# EAGLE schematic SDMAC_revb (EAGLE 9.6.2)

## Sheet 1 of 3
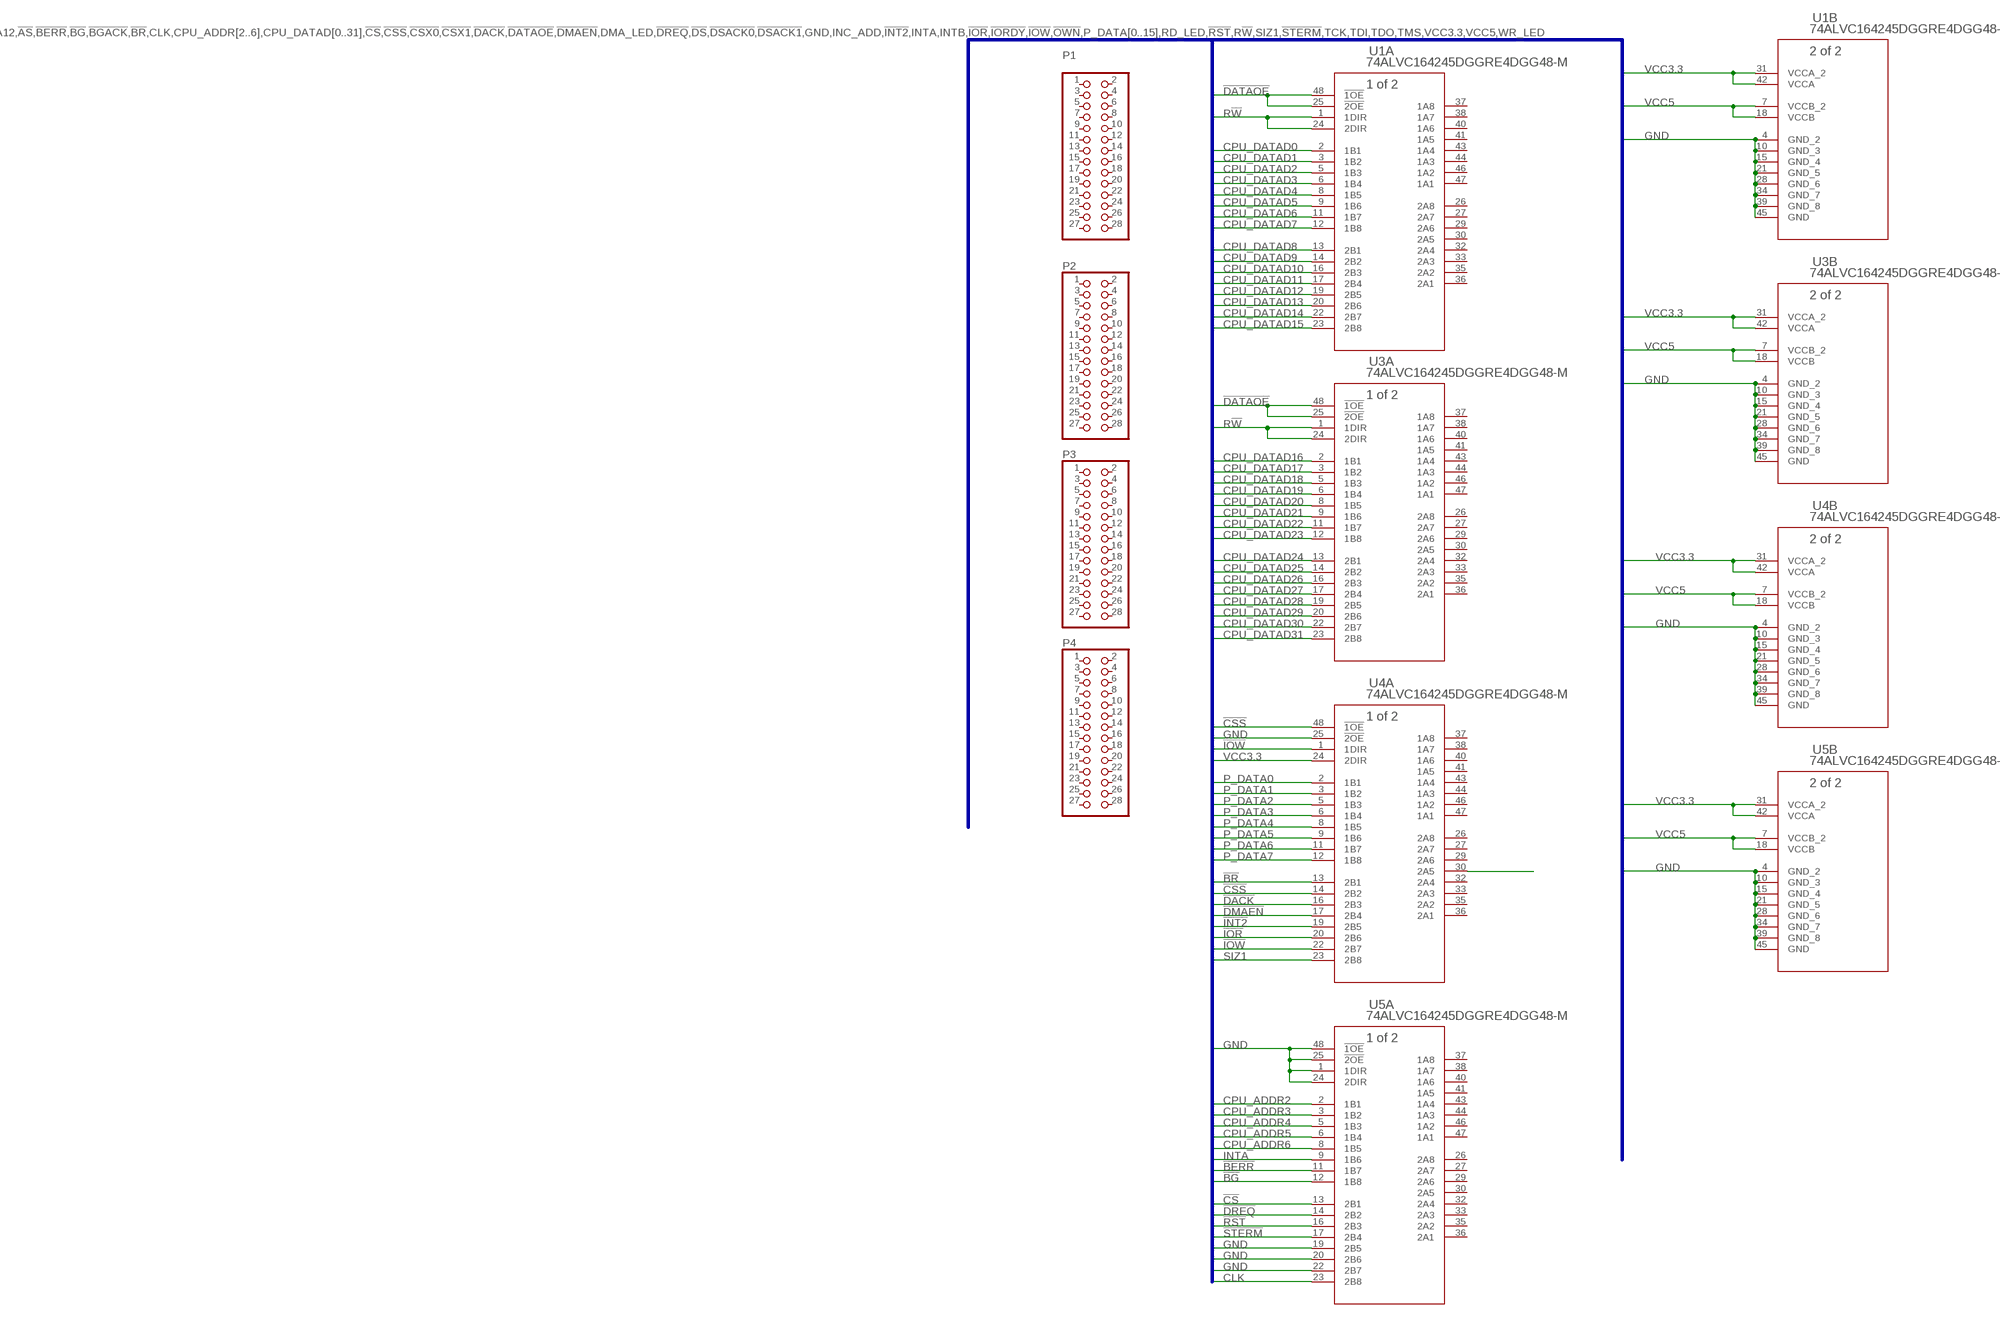
[diagram p0: schematic, sheet 1]

### Parts
P1  PINHD-2X14  [2X14]
P2  PINHD-2X14  [2X14]
P3  PINHD-2X14  [2X14]
P4  PINHD-2X14  [2X14]
U1  74ALVC164245DGGRE4DGG48-M  [DGG48-M]
U3  74ALVC164245DGGRE4DGG48-M  [DGG48-M]
U4  74ALVC164245DGGRE4DGG48-M  [DGG48-M]
U5  74ALVC164245DGGRE4DGG48-M  [DGG48-M]

### Nets
!BERR: U5.11(A:1B7) ; also sheet 2
!BG: U5.12(A:1B8) ; also sheet 2
!BR: U4.13(A:2B1) ; also sheet 2
!CS: U5.13(A:2B1) ; also sheet 2
!CSS: U4.14(A:2B2) U4.48(A:!1OE) ; also sheet 2
!DACK: U4.16(A:2B3) ; also sheet 2
!DATAOE: U1.25(A:!2OE) U1.48(A:!1OE) U3.25(A:!2OE) U3.48(A:!1OE)
!DMAEN: U4.17(A:2B4) ; also sheet 2
!DREQ: U5.14(A:2B2) ; also sheet 2
!INT2: U4.19(A:2B5) ; also sheet 2
!IOR: U4.20(A:2B6) ; also sheet 2
!IOW: U4.1(A:1DIR) U4.22(A:2B7) ; also sheet 2
!RST: U5.16(A:2B3) ; also sheet 2
!STERM: U5.17(A:2B4) ; also sheet 2
CLK: U5.23(A:2B8) ; also sheet 2
CPU_ADDR2: U5.2(A:1B1) ; also sheet 2
CPU_ADDR3: U5.3(A:1B2) ; also sheet 2
CPU_ADDR4: U5.5(A:1B3) ; also sheet 2
CPU_ADDR5: U5.6(A:1B4) ; also sheet 2
CPU_ADDR6: U5.8(A:1B5) ; also sheet 2
CPU_DATAD0: U1.2(A:1B1) ; also sheet 2
CPU_DATAD1: U1.3(A:1B2) ; also sheet 2
CPU_DATAD2: U1.5(A:1B3) ; also sheet 2
CPU_DATAD3: U1.6(A:1B4) ; also sheet 2
CPU_DATAD4: U1.8(A:1B5) ; also sheet 2
CPU_DATAD5: U1.9(A:1B6) ; also sheet 2
CPU_DATAD6: U1.11(A:1B7) ; also sheet 2
CPU_DATAD7: U1.12(A:1B8) ; also sheet 2
CPU_DATAD8: U1.13(A:2B1) ; also sheet 2
CPU_DATAD9: U1.14(A:2B2) ; also sheet 2
CPU_DATAD10: U1.16(A:2B3) ; also sheet 2
CPU_DATAD11: U1.17(A:2B4) ; also sheet 2
CPU_DATAD12: U1.19(A:2B5) ; also sheet 2
CPU_DATAD13: U1.20(A:2B6) ; also sheet 2
CPU_DATAD14: U1.22(A:2B7) ; also sheet 2
CPU_DATAD15: U1.23(A:2B8) ; also sheet 2
CPU_DATAD16: U3.2(A:1B1) ; also sheet 2
CPU_DATAD17: U3.3(A:1B2) ; also sheet 2
CPU_DATAD18: U3.5(A:1B3) ; also sheet 2
CPU_DATAD19: U3.6(A:1B4) ; also sheet 2
CPU_DATAD20: U3.8(A:1B5) ; also sheet 2
CPU_DATAD21: U3.9(A:1B6) ; also sheet 2
CPU_DATAD22: U3.11(A:1B7) ; also sheet 2
CPU_DATAD23: U3.12(A:1B8) ; also sheet 2
CPU_DATAD24: U3.13(A:2B1) ; also sheet 2
CPU_DATAD25: U3.14(A:2B2) ; also sheet 2
CPU_DATAD26: U3.16(A:2B3) ; also sheet 2
CPU_DATAD27: U3.17(A:2B4) ; also sheet 2
CPU_DATAD28: U3.19(A:2B5) ; also sheet 2
CPU_DATAD29: U3.20(A:2B6) ; also sheet 2
CPU_DATAD30: U3.22(A:2B7) ; also sheet 2
CPU_DATAD31: U3.23(A:2B8) ; also sheet 2
GND: U1.4(B:GND_2) U1.10(B:GND_3) U1.15(B:GND_4) U1.21(B:GND_5) U1.28(B:GND_6) U1.34(B:GND_7) U1.39(B:GND_8) U1.45(B:GND) U3.4(B:GND_2) U3.10(B:GND_3) U3.15(B:GND_4) U3.21(B:GND_5) U3.28(B:GND_6) U3.34(B:GND_7) U3.39(B:GND_8) U3.45(B:GND) U4.4(B:GND_2) U4.10(B:GND_3) U4.15(B:GND_4) U4.21(B:GND_5) U4.25(A:!2OE) U4.28(B:GND_6) U4.34(B:GND_7) U4.39(B:GND_8) U4.45(B:GND) U5.1(A:1DIR) U5.4(B:GND_2) U5.10(B:GND_3) U5.15(B:GND_4) U5.19(A:2B5) U5.20(A:2B6) U5.21(B:GND_5) U5.22(A:2B7) U5.24(A:2DIR) U5.25(A:!2OE) U5.28(B:GND_6) U5.34(B:GND_7) U5.39(B:GND_8) U5.45(B:GND) U5.48(A:!1OE) ; also sheet 2,3
INTA: U5.9(A:1B6) ; also sheet 2
P1-1: U4.30(A:2A5)
P_DATA0: U4.2(A:1B1) ; also sheet 2
P_DATA1: U4.3(A:1B2) ; also sheet 2
P_DATA2: U4.5(A:1B3) ; also sheet 2
P_DATA3: U4.6(A:1B4) ; also sheet 2
P_DATA4: U4.8(A:1B5) ; also sheet 2
P_DATA5: U4.9(A:1B6) ; also sheet 2
P_DATA6: U4.11(A:1B7) ; also sheet 2
P_DATA7: U4.12(A:1B8) ; also sheet 2
R!W: U1.1(A:1DIR) U1.24(A:2DIR) U3.1(A:1DIR) U3.24(A:2DIR) ; also sheet 2
SIZ1: U4.23(A:2B8) ; also sheet 2
VCC3.3: U1.31(B:VCCA_2) U1.42(B:VCCA) U3.31(B:VCCA_2) U3.42(B:VCCA) U4.24(A:2DIR) U4.31(B:VCCA_2) U4.42(B:VCCA) U5.31(B:VCCA_2) U5.42(B:VCCA) ; also sheet 3
VCC5: U1.7(B:VCCB_2) U1.18(B:VCCB) U3.7(B:VCCB_2) U3.18(B:VCCB) U4.7(B:VCCB_2) U4.18(B:VCCB) U5.7(B:VCCB_2) U5.18(B:VCCB) ; also sheet 2
Unconnected: P1.1 P1.2 P1.3 P1.4 P1.5 P1.6 P1.7 P1.8 P1.9 P1.10 P1.11 P1.12 P1.13 P1.14 P1.15 P1.16 P1.17 P1.18 P1.19 P1.20 P1.21 P1.22 P1.23 P1.24 P1.25 P1.26 P1.27 P1.28 P2.1 P2.2 P2.3 P2.4 P2.5 P2.6 P2.7 P2.8 P2.9 P2.10 P2.11 P2.12 P2.13 P2.14 P2.15 P2.16 P2.17 P2.18 P2.19 P2.20 P2.21 P2.22 P2.23 P2.24 P2.25 P2.26 P2.27 P2.28 P3.1 P3.2 P3.3 P3.4 P3.5 P3.6 P3.7 P3.8 P3.9 P3.10 P3.11 P3.12 P3.13 P3.14 P3.15 P3.16 P3.17 P3.18 P3.19 P3.20 P3.21 P3.22 P3.23 P3.24 P3.25 P3.26 P3.27 P3.28 P4.1 P4.2 P4.3 P4.4 P4.5 P4.6 P4.7 P4.8 P4.9 P4.10 P4.11 P4.12 P4.13 P4.14 P4.15 P4.16 P4.17 P4.18 P4.19 P4.20 P4.21 P4.22 P4.23 P4.24 P4.25 P4.26 P4.27 P4.28 U1.26(A:2A8) U1.27(A:2A7) U1.29(A:2A6) U1.30(A:2A5) U1.32(A:2A4) U1.33(A:2A3) U1.35(A:2A2) U1.36(A:2A1) U1.37(A:1A8) U1.38(A:1A7) U1.40(A:1A6) U1.41(A:1A5) U1.43(A:1A4) U1.44(A:1A3) U1.46(A:1A2) U1.47(A:1A1) U3.26(A:2A8) U3.27(A:2A7) U3.29(A:2A6) U3.30(A:2A5) U3.32(A:2A4) U3.33(A:2A3) U3.35(A:2A2) U3.36(A:2A1) U3.37(A:1A8) U3.38(A:1A7) U3.40(A:1A6) U3.41(A:1A5) U3.43(A:1A4) U3.44(A:1A3) U3.46(A:1A2) U3.47(A:1A1) U4.26(A:2A8) U4.27(A:2A7) U4.29(A:2A6) U4.32(A:2A4) U4.33(A:2A3) U4.35(A:2A2) U4.36(A:2A1) U4.37(A:1A8) U4.38(A:1A7) U4.40(A:1A6) U4.41(A:1A5) U4.43(A:1A4) U4.44(A:1A3) U4.46(A:1A2) U4.47(A:1A1) U5.26(A:2A8) U5.27(A:2A7) U5.29(A:2A6) U5.30(A:2A5) U5.32(A:2A4) U5.33(A:2A3) U5.35(A:2A2) U5.36(A:2A1) U5.37(A:1A8) U5.38(A:1A7) U5.40(A:1A6) U5.41(A:1A5) U5.43(A:1A4) U5.44(A:1A3) U5.46(A:1A2) U5.47(A:1A1)

### Buses
MASTERBUS:A12,!AS,!BERR,!BG,!BGACK,!BR,CLK,CPU_ADDR[2..6],CPU_DATAD[0..31],!CS,!CSS,!CSX0,!CSX1,!DACK,!DATAOE,!DMAEN,DMA_LED,!DREQ,!DS,!DSACK0,!DSACK1,GND,INC_ADD,!INT2,INTA,INTB,!IOR,!IORDY,!IOW,!OWN,P_DATA[0..15],RD_LED,!RST,R!W,SIZ1,!STERM,TCK,TDI,TDO,TMS,VCC3.3,VCC5,WR_LED

## Sheet 2 of 3
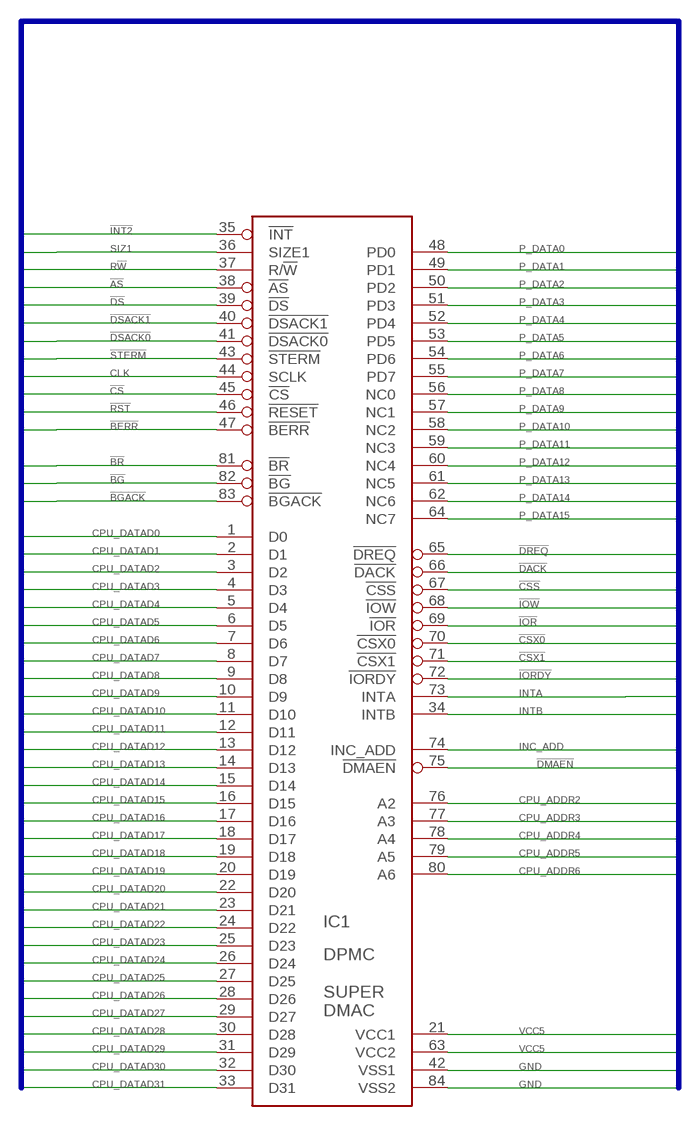
[diagram p1: schematic, sheet 2]

### Parts
IC1  SUPER_DMAC_THT  [PLCC84_T]

### Nets
!AS: IC1.38(!AS)
!BERR: IC1.47(!BERR) ; also sheet 1
!BG: IC1.82(!BG) ; also sheet 1
!BGACK: IC1.83(!BGACK)
!BR: IC1.81(!BR) ; also sheet 1
!CS: IC1.45(!CS) ; also sheet 1
!CSS: IC1.67(!CSS) ; also sheet 1
!CSX0: IC1.70(!CSX0)
!CSX1: IC1.71(!CSX1)
!DACK: IC1.66(!DACK) ; also sheet 1
!DMAEN: IC1.75(!DMAEN) ; also sheet 1
!DREQ: IC1.65(!DREQ) ; also sheet 1
!DS: IC1.39(!DS)
!DSACK0: IC1.41(!DSACK0)
!DSACK1: IC1.40(!DSACK1)
!INT2: IC1.35(!INT) ; also sheet 1
!IOR: IC1.69(!IOR) ; also sheet 1
!IORDY: IC1.72(!IORDY)
!IOW: IC1.68(!IOW) ; also sheet 1
!RST: IC1.46(!RESET) ; also sheet 1
!STERM: IC1.43(!STERM) ; also sheet 1
CLK: IC1.44(SCLK) ; also sheet 1
CPU_ADDR2: IC1.76(A2) ; also sheet 1
CPU_ADDR3: IC1.77(A3) ; also sheet 1
CPU_ADDR4: IC1.78(A4) ; also sheet 1
CPU_ADDR5: IC1.79(A5) ; also sheet 1
CPU_ADDR6: IC1.80(A6) ; also sheet 1
CPU_DATAD0: IC1.1(D0) ; also sheet 1
CPU_DATAD1: IC1.2(D1) ; also sheet 1
CPU_DATAD2: IC1.3(D2) ; also sheet 1
CPU_DATAD3: IC1.4(D3) ; also sheet 1
CPU_DATAD4: IC1.5(D4) ; also sheet 1
CPU_DATAD5: IC1.6(D5) ; also sheet 1
CPU_DATAD6: IC1.7(D6) ; also sheet 1
CPU_DATAD7: IC1.8(D7) ; also sheet 1
CPU_DATAD8: IC1.9(D8) ; also sheet 1
CPU_DATAD9: IC1.10(D9) ; also sheet 1
CPU_DATAD10: IC1.11(D10) ; also sheet 1
CPU_DATAD11: IC1.12(D11) ; also sheet 1
CPU_DATAD12: IC1.13(D12) ; also sheet 1
CPU_DATAD13: IC1.14(D13) ; also sheet 1
CPU_DATAD14: IC1.15(D14) ; also sheet 1
CPU_DATAD15: IC1.16(D15) ; also sheet 1
CPU_DATAD16: IC1.17(D16) ; also sheet 1
CPU_DATAD17: IC1.18(D17) ; also sheet 1
CPU_DATAD18: IC1.19(D18) ; also sheet 1
CPU_DATAD19: IC1.20(D19) ; also sheet 1
CPU_DATAD20: IC1.22(D20) ; also sheet 1
CPU_DATAD21: IC1.23(D21) ; also sheet 1
CPU_DATAD22: IC1.24(D22) ; also sheet 1
CPU_DATAD23: IC1.25(D23) ; also sheet 1
CPU_DATAD24: IC1.26(D24) ; also sheet 1
CPU_DATAD25: IC1.27(D25) ; also sheet 1
CPU_DATAD26: IC1.28(D26) ; also sheet 1
CPU_DATAD27: IC1.29(D27) ; also sheet 1
CPU_DATAD28: IC1.30(D28) ; also sheet 1
CPU_DATAD29: IC1.31(D29) ; also sheet 1
CPU_DATAD30: IC1.32(D30) ; also sheet 1
CPU_DATAD31: IC1.33(D31) ; also sheet 1
GND: IC1.42(VSS1) IC1.84(VSS2) ; also sheet 1,3
INC_ADD: IC1.74(INC_ADD)
INTA: IC1.73(INTA) ; also sheet 1
INTB: IC1.34(INTB)
P_DATA0: IC1.48(PD0) ; also sheet 1
P_DATA1: IC1.49(PD1) ; also sheet 1
P_DATA2: IC1.50(PD2) ; also sheet 1
P_DATA3: IC1.51(PD3) ; also sheet 1
P_DATA4: IC1.52(PD4) ; also sheet 1
P_DATA5: IC1.53(PD5) ; also sheet 1
P_DATA6: IC1.54(PD6) ; also sheet 1
P_DATA7: IC1.55(PD7) ; also sheet 1
P_DATA8: IC1.56(NC0)
P_DATA9: IC1.57(NC1)
P_DATA10: IC1.58(NC2)
P_DATA11: IC1.59(NC3)
P_DATA12: IC1.60(NC4)
P_DATA13: IC1.61(NC5)
P_DATA14: IC1.62(NC6)
P_DATA15: IC1.64(NC7)
R!W: IC1.37(R/!W!) ; also sheet 1
SIZ1: IC1.36(SIZE1) ; also sheet 1
VCC5: IC1.21(VCC1) IC1.63(VCC2) ; also sheet 1

### Buses
!AS,!BERR,!BG,!BGACK,!BR,CLK,CPU_ADDR[2..6],CPU_DATAD[0..31],!CS,!CSS,!CSX0,!CSX1,!DACK,!DMAEN,!DREQ,!DS,!DSACK0,!DSACK1,GND,INC_ADD,!INT2,INTA,INTB,!IOR,!IORDY,!IOW,P_DATA[0..15],!RST,R!W,SIZ1,!STERM,TCK,TDI,TDO,TMS,VCC3.3,VCC5

## Sheet 3 of 3
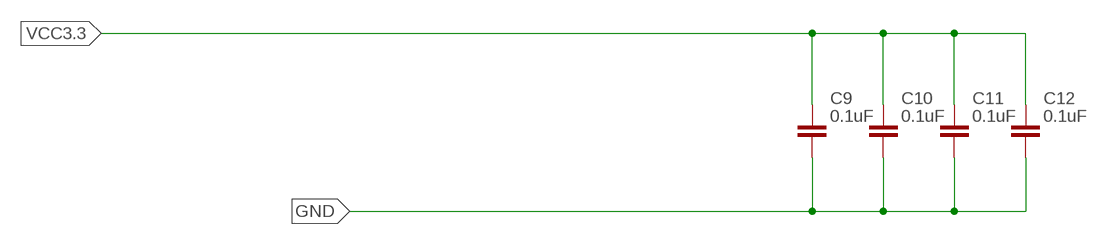
[diagram p2: schematic, sheet 3]

### Parts
C9  0.1uF  C_CHIP-0805(2012-METRIC)  [CAPC2012X110]
C10  0.1uF  C_CHIP-0805(2012-METRIC)  [CAPC2012X110]
C11  0.1uF  C_CHIP-0805(2012-METRIC)  [CAPC2012X110]
C12  0.1uF  C_CHIP-0805(2012-METRIC)  [CAPC2012X110]

### Nets
GND: C9.2 C10.2 C11.2 C12.2 ; also sheet 1,2
VCC3.3: C9.1 C10.1 C11.1 C12.1 ; also sheet 1

## Library data of the parts
C9-C12 = Capacitor:C: Capacitor - Generic; CATEGORY: Capacitor
IC1 = Amiga:SUPER_DMAC
P1-P4 = pinhead:PINHD-2X14: PIN HEADER
U1 U3-U5 = 74alvc164254:74ALVC164245DGGRE4; COPYRIGHT: Copyright (C) 2023 Ultra Librarian. All rights reserved.; MANUFACTURER_PART_NUMBER: 74ALVC164245DGGRE4; MFR_NAME: Texas Instruments